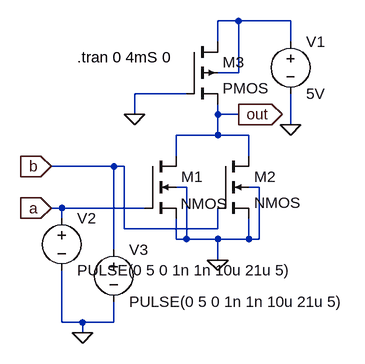
[diagram p0: schematic pseudo_nmos_NOR.asc]
pseudo_nmos_NOR.asc, the LTspice schematic file:
Version 4
SHEET 1 880 680
WIRE 256 -80 224 -80
WIRE 336 -80 256 -80
WIRE 224 -48 224 -80
WIRE 336 -48 336 -80
WIRE 256 0 256 -80
WIRE 256 0 224 0
WIRE 176 32 96 32
WIRE 96 64 96 32
WIRE 224 64 224 48
WIRE 256 64 224 64
WIRE 336 80 336 32
WIRE 224 96 224 64
WIRE 224 96 160 96
WIRE 272 96 224 96
WIRE 160 128 160 96
WIRE 272 128 272 96
WIRE 64 144 -32 144
WIRE 80 144 64 144
WIRE 176 176 160 176
WIRE 288 176 272 176
WIRE -16 208 -32 208
WIRE 112 208 -16 208
WIRE -16 224 -16 208
WIRE 80 240 80 144
WIRE 224 240 224 208
WIRE 224 240 80 240
WIRE 160 256 160 224
WIRE 176 256 176 176
WIRE 176 256 160 256
WIRE 224 256 176 256
WIRE 272 256 272 224
WIRE 272 256 224 256
WIRE 288 256 288 176
WIRE 288 256 272 256
WIRE 64 272 64 144
WIRE 224 288 224 256
WIRE -16 384 -16 304
WIRE 16 384 -16 384
WIRE 64 384 64 352
WIRE 64 384 16 384
WIRE 16 400 16 384
FLAG -32 208 a
IOPIN -32 208 In
FLAG -32 144 b
IOPIN -32 144 In
FLAG 96 64 0
FLAG 336 80 0
FLAG 16 400 0
FLAG 256 64 out
IOPIN 256 64 Out
FLAG 224 288 0
SYMBOL nmos4 112 128 R0
WINDOW 3 91 58 Top 2
SYMATTR InstName M1
SYMBOL nmos4 224 128 R0
SYMATTR InstName M2
SYMBOL pmos4 176 -48 R0
SYMATTR InstName M3
SYMBOL voltage 336 -64 R0
WINDOW 123 0 0 Left 0
WINDOW 39 0 0 Left 0
SYMATTR InstName V1
SYMATTR Value 5V
SYMBOL voltage -16 208 R0
WINDOW 123 0 0 Left 0
WINDOW 39 0 0 Left 0
SYMATTR InstName V2
SYMATTR Value PULSE(0 5 0 1n 1n 10u 21u 5)
SYMBOL voltage 64 256 R0
WINDOW 123 0 0 Left 0
WINDOW 39 0 0 Left 0
SYMATTR InstName V3
SYMATTR Value PULSE(0 5 0 1n 1n 10u 21u 5)
TEXT 8 -24 Left 2 !.tran 0 4mS 0

The netlist it stands for:
* pseudo_nmos_NOR.asc
M1 out a 0 0 NMOS
M2 out b 0 0 NMOS
M3 N001 0 out N001 PMOS
V1 N001 0 5V
V2 a 0 PULSE(0 5 0 1n 1n 10u 21u 5)
V3 b 0 PULSE(0 5 0 1n 1n 10u 21u 5)
.model NMOS NMOS
.model PMOS PMOS
.lib standard.mos
.tran 0 4mS 0
.backanno
.end